# Altium schematic sheet Connector.SchDoc
size A4; Author: Shohei Aoki; Organization: Shokara Inc.; Address1: Yokohama, Japan
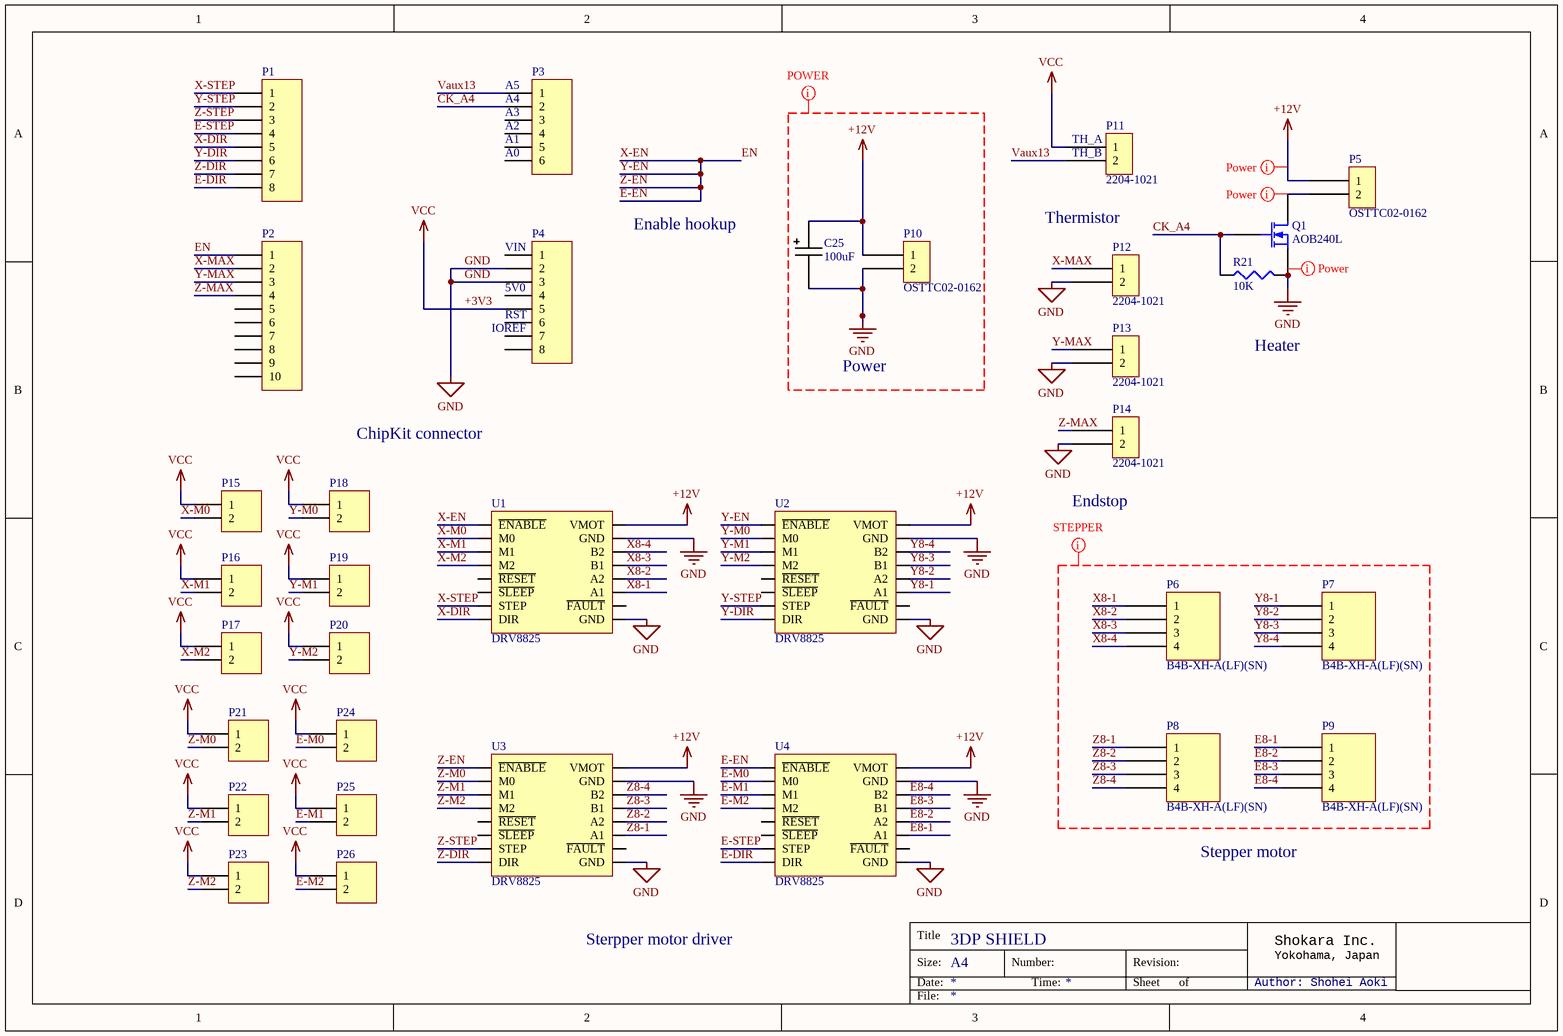
[diagram p0: Connector.SchDoc]

## Parts
C25  Cap_alumi_electrolytic  [EEE-1HA101UP]  (value not drawn)
P1  (no value)  [HDR1X8]
P2  (no value)  [HDR1X10]
P3  (no value)  [HDR1X6]
P4  (no value)  [HDR1X8]
P5  OSTTC02-0162  [OSTTC02-0162]
P6  B4B-XH-A(LF)(SN)  [B4B-XH-A]
P7  B4B-XH-A(LF)(SN)  [B4B-XH-A]
P8  B4B-XH-A(LF)(SN)  [B4B-XH-A]
P9  B4B-XH-A(LF)(SN)  [B4B-XH-A]
P10  OSTTC02-0162  [OSTTC02-0162]
P11  2204-1021  [MOLEX_2204_1021]
P12  2204-1021  [MOLEX_2204_1021]
P13  2204-1021  [MOLEX_2204_1021]
P14  2204-1021  [MOLEX_2204_1021]
P15  Header 2  [HDR1X2]  (value not drawn)
P16  Header 2  [HDR1X2]  (value not drawn)
P17  Header 2  [HDR1X2]  (value not drawn)
P18  Header 2  [HDR1X2]  (value not drawn)
P19  Header 2  [HDR1X2]  (value not drawn)
P20  Header 2  [HDR1X2]  (value not drawn)
P21  Header 2  [HDR1X2]  (value not drawn)
P22  Header 2  [HDR1X2]  (value not drawn)
P23  Header 2  [HDR1X2]  (value not drawn)
P24  Header 2  [HDR1X2]  (value not drawn)
P25  Header 2  [HDR1X2]  (value not drawn)
P26  Header 2  [HDR1X2]  (value not drawn)
Q1  AOB240L  [DPAK254P1524X483-3N]
R21  value 10K  [J1-0603]
U1  DRV8825  [DRV8825]
U2  DRV8825  [DRV8825]
U3  DRV8825  [DRV8825]
U4  DRV8825  [DRV8825]

## Nets
+3V3: P4.5 P11.1 P15.1 P16.1 P17.1 P18.1 P19.1 P20.1 P21.1 P22.1 P23.1 P24.1 P25.1 P26.1  [also labelled VCC]
+12V: C25.2 P5.1 P10.1 U1.VMOT U2.VMOT U3.VMOT U4.VMOT
GND: C25.1 P4.2 P4.3 P10.2 P12.2 P13.2 P14.2 Q1.3(S) R21.2 U1.GND U2.GND U3.GND U4.GND
CK_A4: P3.2 Q1.1(G) R21.1
E8-1: P9.1 U4.A1
E8-2: P9.2 U4.A2
E8-3: P9.3 U4.B1
E8-4: P9.4 U4.B2
E-DIR: P1.8 U4.DIR
E-EN: P2.1 U1.ENABLE(~{ENABLE}) U2.ENABLE(~{ENABLE}) U3.ENABLE(~{ENABLE}) U4.ENABLE(~{ENABLE})  [also labelled EN, X-EN, Y-EN, Z-EN]
E-M0: P24.2 U4.M0
E-M1: P25.2 U4.M1
E-M2: P26.2 U4.M2
E-STEP: P1.4 U4.STEP
Vaux13: P3.1 P11.2
X8-1: P6.1 U1.A1
X8-2: P6.2 U1.A2
X8-3: P6.3 U1.B1
X8-4: P6.4 U1.B2
X-DIR: P1.5 U1.DIR
X-M0: P15.2 U1.M0
X-M1: P16.2 U1.M1
X-M2: P17.2 U1.M2
X-MAX: P2.2 P12.1
X-STEP: P1.1 U1.STEP
Y8-1: P7.1 U2.A1
Y8-2: P7.2 U2.A2
Y8-3: P7.3 U2.B1
Y8-4: P7.4 U2.B2
Y-DIR: P1.6 U2.DIR
Y-M0: P18.2 U2.M0
Y-M1: P19.2 U2.M1
Y-M2: P20.2 U2.M2
Y-MAX: P2.3 P13.1
Y-STEP: P1.2 U2.STEP
Z8-1: P8.1 U3.A1
Z8-2: P8.2 U3.A2
Z8-3: P8.3 U3.B1
Z8-4: P8.4 U3.B2
Z-DIR: P1.7 U3.DIR
Z-M0: P21.2 U3.M0
Z-M1: P22.2 U3.M1
Z-M2: P23.2 U3.M2
Z-MAX: P2.4 P14.1
Z-STEP: P1.3 U3.STEP
NetP5_2: P5.2 Q1.4(D)

Not connected (* = marked no-connect by the designer): P2 5 6 7 8 9 10; P3 3 4 5 6; P4 1 4 6 7 8; Q1 2(NC); U1 FAULT(~{FAULT}) RESET(~{RESET}) SLEEP(~{SLEEP}); U2 FAULT(~{FAULT}) RESET(~{RESET}) SLEEP(~{SLEEP}); U3 FAULT(~{FAULT}) RESET(~{RESET}) SLEEP(~{SLEEP}); U4 FAULT(~{FAULT}) RESET(~{RESET}) SLEEP(~{SLEEP})

## Layout directives
net class Power: (no net found under the mark), +12V, GND, NetP5_2
net class Stepper: E8-1, E8-2, E8-3, E8-4, X8-1, X8-2, X8-3, X8-4, Y8-1, Y8-2, Y8-3, Y8-4, Z8-1, Z8-2, Z8-3, Z8-4

## Notes on the sheet
- (near P3) A5
- (near P3) A4
- (near P3) A3
- (near P3) A2
- (near P3) A1
- (near P3) A0
- (near P11) TH_A
- (near P11) TH_B
- (near P4) VIN
- Enable hookup
- Thermistor
- (near P4) 5V0
- (near P4) IOREF
- (near P4) RST
- Power
- Heater
- ChipKit connector
- (near P14) Endstop
- Stepper motor
- Sterpper motor driver
- 3DP SHIELD
- Title
- Size:
- Date:
- Number:
- Time:
- Revision:
- Sheet
- of
- Author: Shohei Aoki
- Shokara Inc.
- Yokohama, Japan
- File:
- (in symbol Cap_alumi_electrolytic) 100uF

## Library data of the parts
P1 P4 = Header 8: Header, 8-Pin; LatestRevisionDate: 17-Jul-2002; LatestRevisionNote: Re-released for DXP Platform.; Publisher: Altium Limited
P2 = Header 10: Header, 10-Pin; LatestRevisionDate: 17-Jul-2002; LatestRevisionNote: Re-released for DXP Platform.; Publisher: Altium Limited
P3 = Header 6: Header, 6-Pin; LatestRevisionDate: 17-Jul-2002; LatestRevisionNote: Re-released for DXP Platform.; Publisher: Altium Limited
P5 P10 = TERMINAL_BLOCK_1X2
P6-P9 = XH_CONNECTOR_1X4
P11-P14 = MOLEX_1X2_HEADER
P15-P26 = Header 2: Header, 2-Pin; LatestRevisionDate: 17-Jul-2002; LatestRevisionNote: Re-released for DXP Platform.; Publisher: Altium Limited
R21 = Res3: Resistor; Published: 8-Jun-2000; LatestRevisionDate: 29-May-2009; LatestRevisionNote: IPC-7351 Footprint Added.; PackageReference: J1-0603; Publisher: Altium Limited; PackageDescription: Chip Resistor